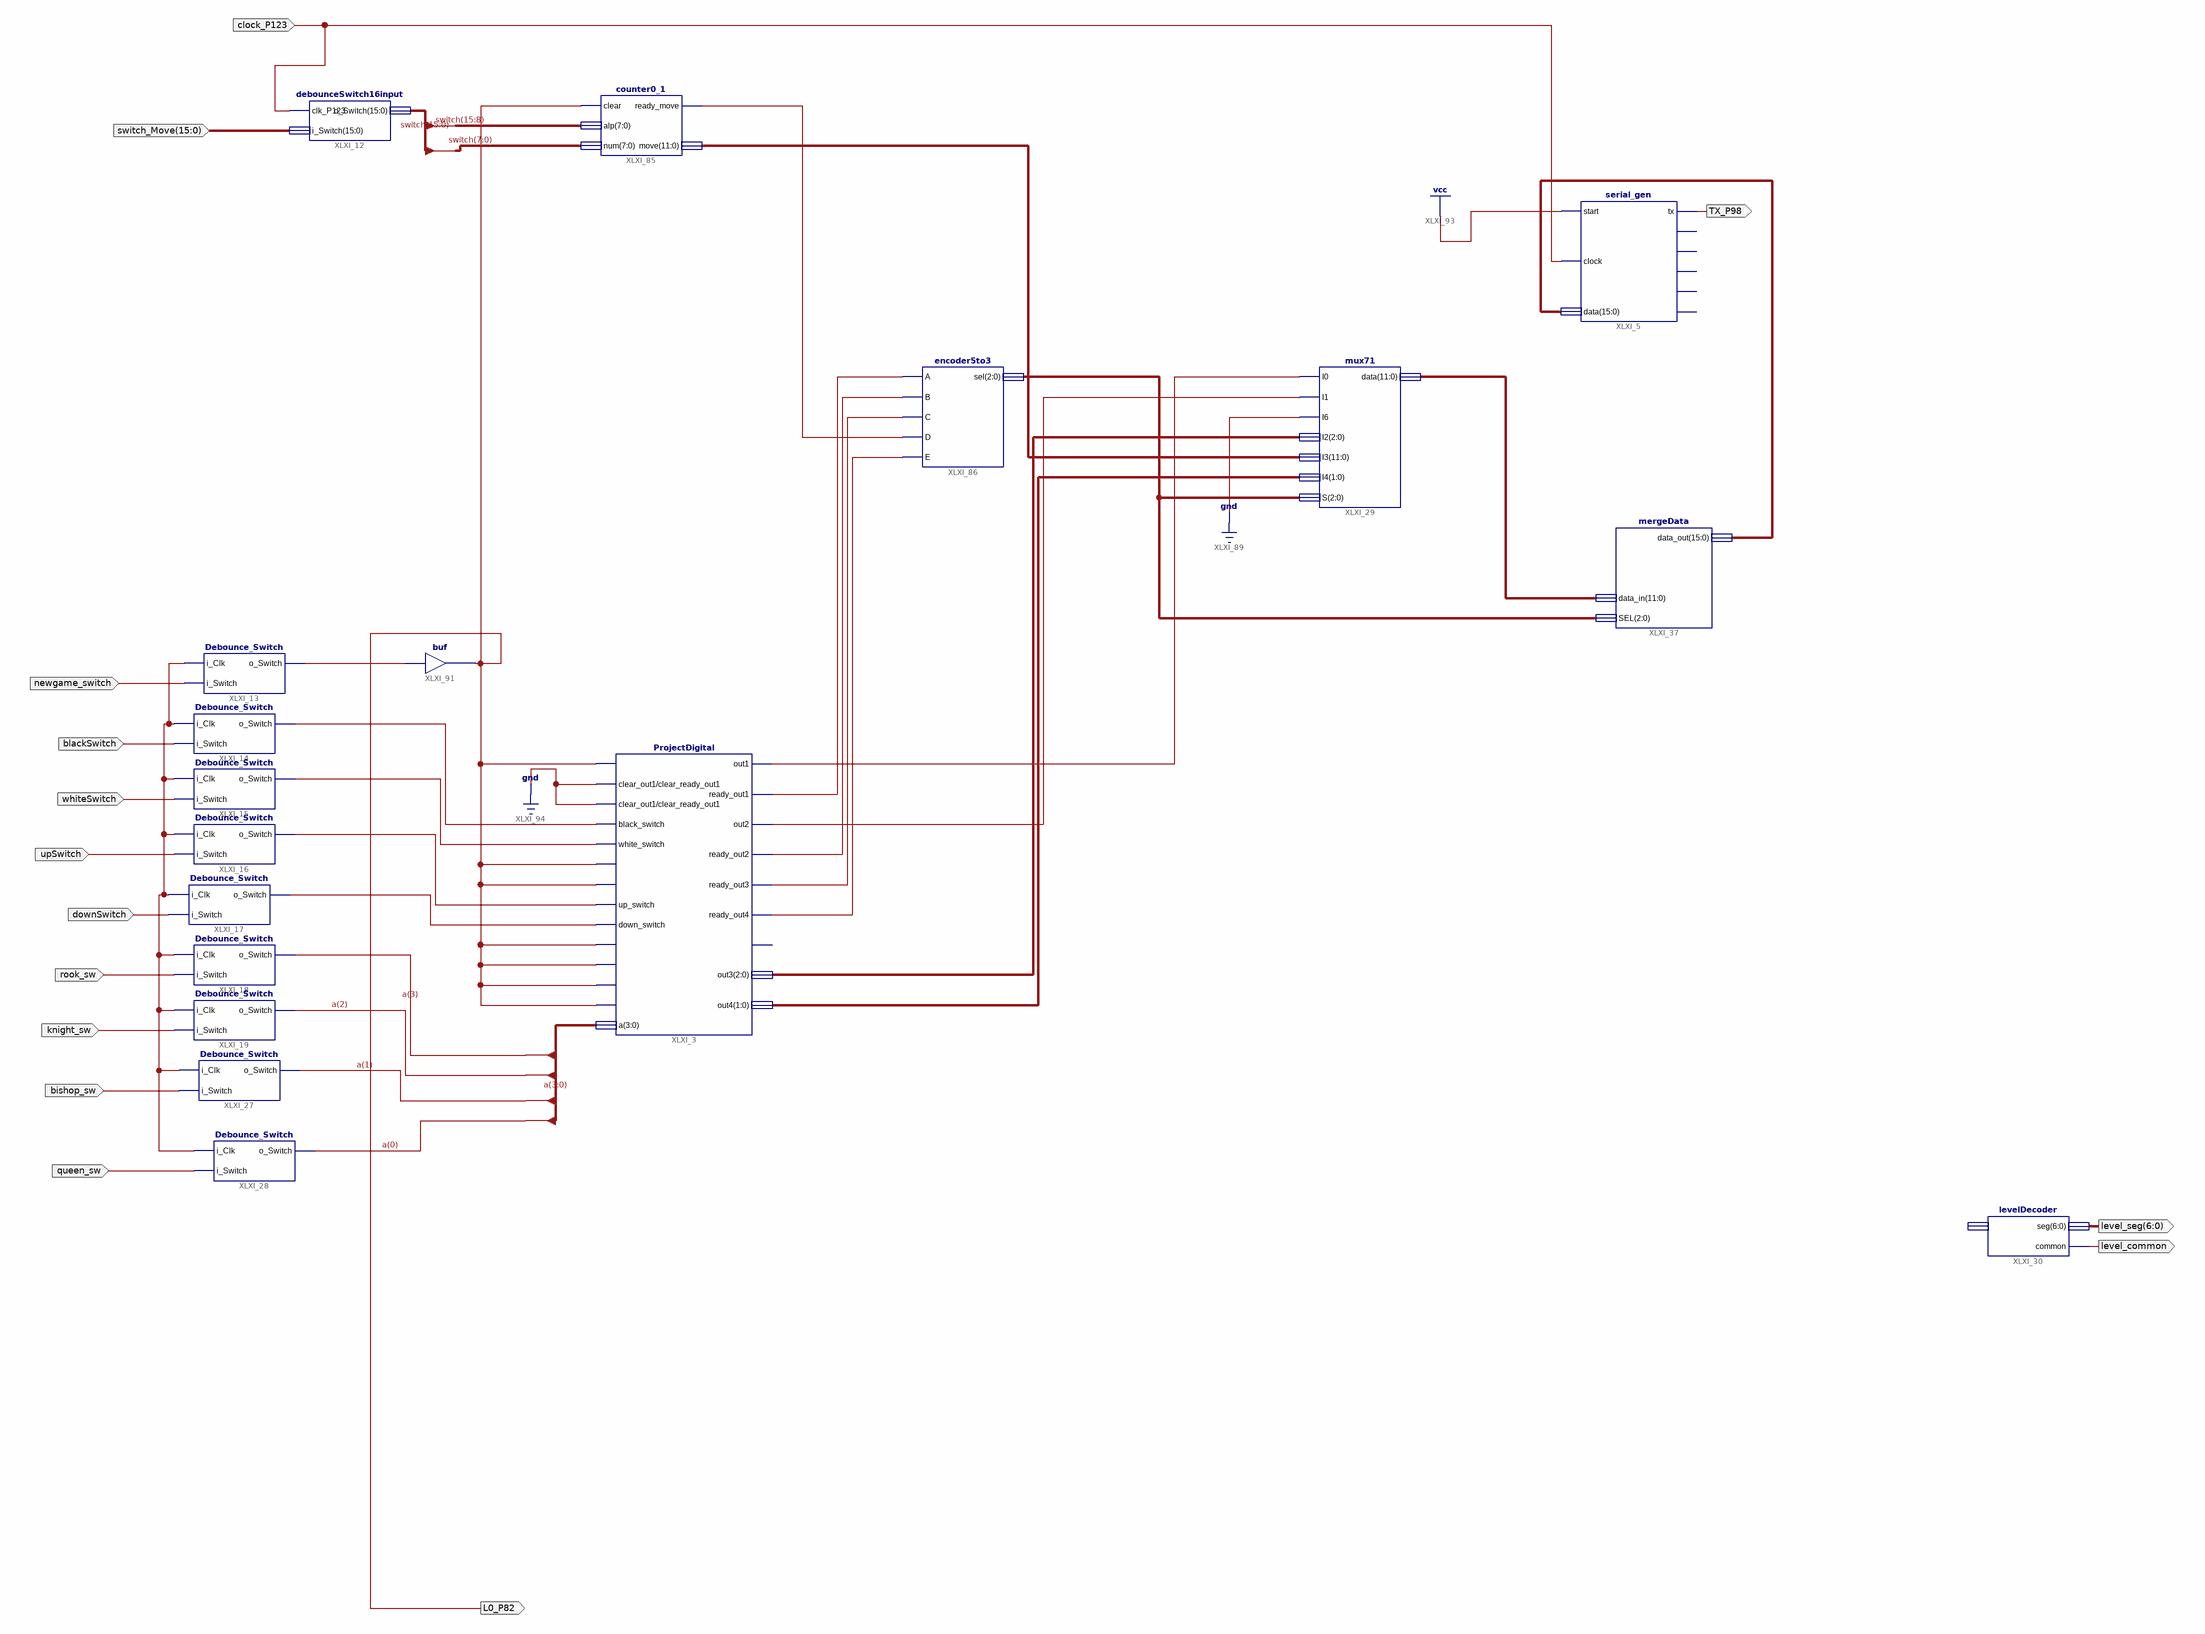
[diagram p0: schematic sheet 1]
// Xilinx ISE schematic tx.sch (spartan6) as structural Verilog: 18 symbols, 15 ports
module tx (
  input  clock_P123,
  input  [15:0] switch_Move,
  input  newgame_switch,
  input  blackSwitch,
  input  whiteSwitch,
  input  upSwitch,
  input  downSwitch,
  input  rook_sw,
  input  knight_sw,
  input  bishop_sw,
  input  queen_sw,
  output [6:0] level_seg,
  output level_common,
  output TX_P98,
  output L0_P82
);

  wire XLXN_236, XLXN_242, XLXN_243, XLXN_244, XLXN_245, XLXN_263, XLXN_265, XLXN_266, XLXN_267, XLXN_268,
       XLXN_273, XLXN_274, XLXN_292;
  wire [1:0] XLXN_270;
  wire [2:0] XLXN_269, XLXN_278;
  wire [3:0] a;
  wire [11:0] XLXN_272, XLXN_310;
  wire [15:0] switch, XLXN_276;

  mux71 XLXI_29 (
    .I0(XLXN_273), .I1(XLXN_274), .I6(1'b0), .I2(XLXN_269), .I3(XLXN_272), .I4(XLXN_270), .S(XLXN_278),
    .data(XLXN_310));
  ProjectDigital XLXI_3 (
    .newgame_switch(L0_P82), .clear_out1(1'b0), .clear_ready_out1(1'b0), .black_switch(XLXN_242),
    .white_switch(XLXN_243), .clear_out2(L0_P82), .clear_ready_out2(L0_P82), .up_switch(XLXN_244),
    .down_switch(XLXN_245), .clear_out3(L0_P82), .clear_ready_out3(L0_P82), .clear_out4(L0_P82),
    .clear_ready_out4(L0_P82), .a(a), .out1(XLXN_273), .ready_out1(XLXN_263), .out2(XLXN_274),
    .ready_out2(XLXN_265), .ready_out3(XLXN_266), .ready_out4(XLXN_267), .out3(XLXN_269), .out4(XLXN_270));  // open: LED_NEW_GAME_SW
  debounceSwitch16input XLXI_12 (.clk_P123(clock_P123), .i_Switch(switch_Move), .o_Switch(switch));
  levelDecoder XLXI_30 (.seg(level_seg), .common(level_common));  // open: inp
  mergeData XLXI_37 (.data_in(XLXN_310), .data_out(XLXN_276), .SEL(XLXN_278));
  Debounce_Switch XLXI_13 (.i_Clk(XLXN_236), .i_Switch(newgame_switch), .o_Switch(XLXN_292));
  Debounce_Switch XLXI_14 (.i_Clk(XLXN_236), .i_Switch(blackSwitch), .o_Switch(XLXN_242));
  Debounce_Switch XLXI_15 (.i_Clk(XLXN_236), .i_Switch(whiteSwitch), .o_Switch(XLXN_243));
  Debounce_Switch XLXI_16 (.i_Clk(XLXN_236), .i_Switch(upSwitch), .o_Switch(XLXN_244));
  Debounce_Switch XLXI_17 (.i_Clk(XLXN_236), .i_Switch(downSwitch), .o_Switch(XLXN_245));
  Debounce_Switch XLXI_18 (.i_Clk(XLXN_236), .i_Switch(rook_sw), .o_Switch(a[3]));
  Debounce_Switch XLXI_19 (.i_Clk(XLXN_236), .i_Switch(knight_sw), .o_Switch(a[2]));
  Debounce_Switch XLXI_27 (.i_Clk(XLXN_236), .i_Switch(bishop_sw), .o_Switch(a[1]));
  Debounce_Switch XLXI_28 (.i_Clk(XLXN_236), .i_Switch(queen_sw), .o_Switch(a[0]));
  counter0_1 XLXI_85 (.clear(L0_P82), .alp(switch[15:8]), .num(switch[7:0]), .ready_move(XLXN_268), .move(XLXN_272));
  encoder5to3 XLXI_86 (.A(XLXN_263), .B(XLXN_265), .C(XLXN_266), .D(XLXN_268), .E(XLXN_267), .sel(XLXN_278));
  serial_gen XLXI_5 (
    .start(1'b1), .clock(clock_P123), .data(XLXN_276), .tx(TX_P98));  // open: clear_NewGame, clear_Color, clear_Move, clear_level, clear_Promote
  buf XLXI_91 (L0_P82, XLXN_292);
endmodule
